# EAGLE design RS232_NPN_PNP+Reset (EAGLE 7.7.0)
RS232 Adapter using NPN and PNP Transistors
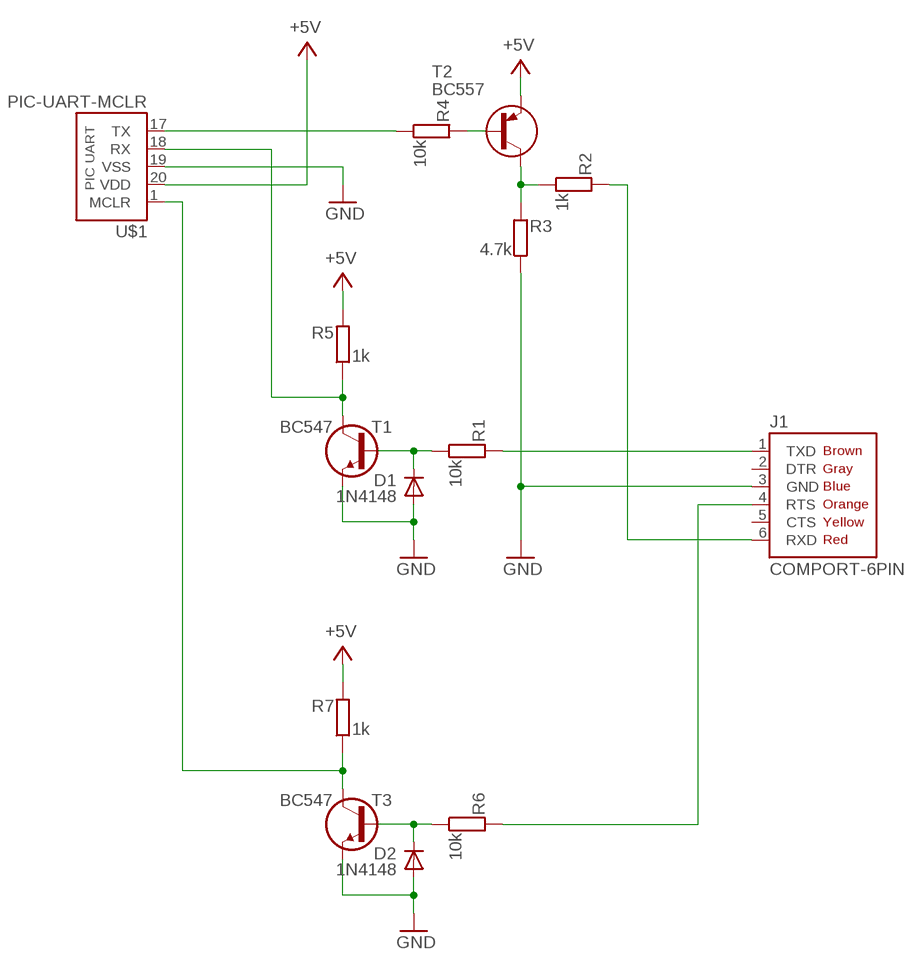
[diagram p0: schematic, sheet 1]

## Parts
D1  1N4148  1N414834-5  [DO34-5]
D2  1N4148  1N414834-5  [DO34-5]
J1  COMPORT-6PIN  [RS232-6PIN]
R1  10k  R0202/5  [0202/5]
R2  1k  R0202/5  [0202/5]
R3  4.7k  R0202/5  [0202/5]
R4  10k  R0202/5  [0202/5]
R5  1k  R0202/5  [0202/5]
R6  10k  R0202/5  [0202/5]
R7  1k  R0202/2V  [0202/2V]
T1  BC547  BC547CBE  [TO92-CBE]
T2  BC557  BC557CBE  [TO92-CBE]
T3  BC547  BC547CBE  [TO92-CBE]
U$1  PIC-UART-MCLR  [PIC-UART-MCLR]

## Nets
+5V: R5.2 R7.2 T2.E U$1.20(VDD)
GND: D1.A D2.A J1.3(GND) R3.1 T1.E T3.E U$1.19(VSS)
N$1: R5.1 T1.C U$1.18(RX)
N$2: D1.C R1.1 T1.B
N$3: J1.1(TXD) R1.2
N$4: R4.1 U$1.17(TX)
N$5: R4.2 T2.B
N$6: R2.1 R3.2 T2.C
N$7: J1.6(RXD) R2.2
N$8: R7.1 T3.C U$1.1(MCLR)
N$9: D2.C R6.1 T3.B
N$10: J1.4(RTS) R6.2
Unconnected: J1.2(DTR) J1.5(CTS)

## Library data of the parts
D1 D2 = d:1N4148
J1 = pinconn:COMPORT-6PIN
R1-R7 = r:R: RESISTOR, European symbol
T1 T3 = t:BC547
T2 = t:BC557
U$1 = pinconn:PIC-UART-MCLR

## Board
RS232 Adapter using NPN and PNP Transistors
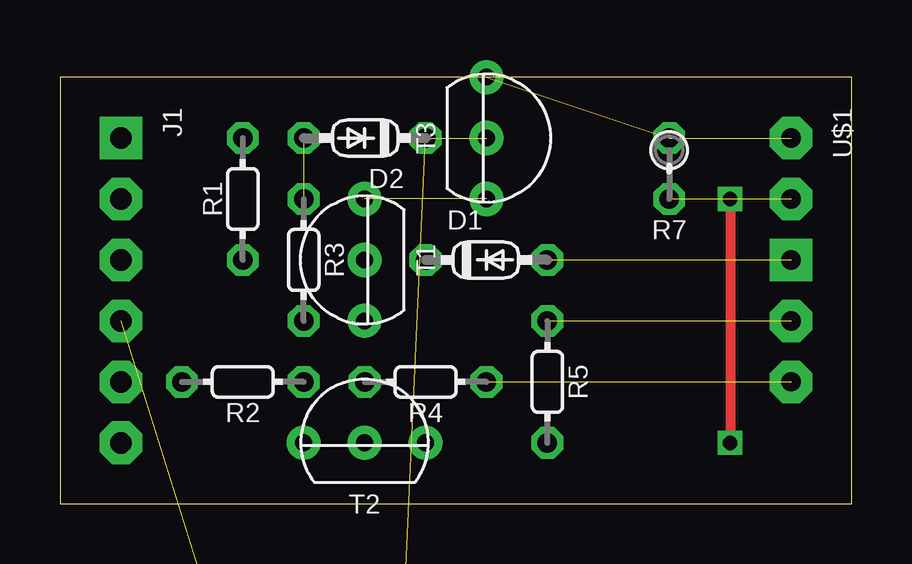
[diagram p1: board, top side]
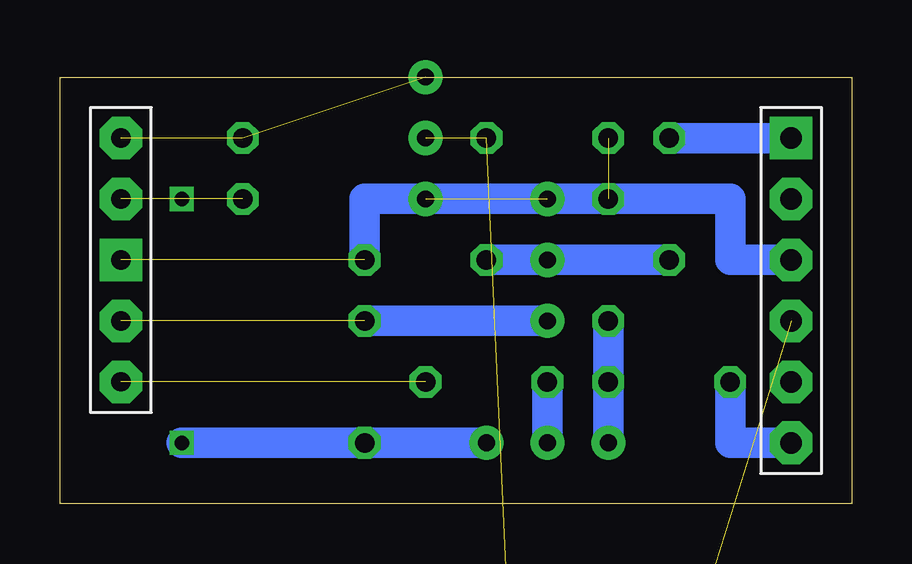
[diagram p2: board, bottom side, seen from below]

Size 33.02 x 17.78 mm. Coordinates in mm from the lower left corner, seen from the top.
Outline: 0,0 33,0 33.02,17.78 0,17.78 0,0
Copper layers (1*16): Top 0.035mm / dielectric 1.5mm / Bottom 0.035mm
Design rules "default": minimum track width 10mil, minimum drill 24mil, track to track 8mil, track to pad 8mil, pad to pad 8mil, via to via 8mil, smd to smd 8mil, copper to edge 40mil, drill to drill 8mil, minimum pad ring 10mil, minimum via ring 8mil, stop-mask expansion 4mil, vias tented up to drill 0mil, thermal gap 10mil

### Footprints (pad centres in the part's own frame; a part is rotated, then mirrored left to right if it is on the bottom)
DO34-5 = drill 0.813 octagon: A 2.54,0; C -2.54,0
RS232-6PIN = drill 0.9 pad 1.778 square: 1 0,0 | drill 0.9 pad 1.778 octagon: 2 2.54,0; 3 5.08,0; 4 7.62,0; 5 10.16,0; 6 12.7,0
0202/5 = drill 0.813 octagon: 1 0,-2.54; 2 0,2.54
0202/2V = drill 0.813 octagon: 1 0,-1.27; 2 0,1.27
TO92-CBE = drill 0.7 pad 1.422: B 0,0; C -2.54,0; E 2.54,0
PIC-UART-MCLR = drill 0.8 pad 1.778 octagon: 1 5.08,0; 17 -5.08,0; 18 -2.54,0; 20 2.54,0 | drill 0.8 pad 1.778 square: 19 0,0

### Placement (x,y rotation side)
D1  17.78,10.16 0 top
D2  12.7,15.24 180 top
J1  2.54,15.24 270 top
R1  7.62,12.7 0 top
R2  7.62,5.08 90 top
R3  10.16,10.16 180 top
R4  15.24,5.08 90 top
R5  20.32,5.08 180 top
R6  11.43,-12.7 90 top  (outside the outline)
R7  25.4,13.97 180 top
T1  12.7,10.16 90 top
T2  12.7,2.54 0 top
T3  17.78,15.24 270 top
U$1  30.48,10.16 90 top

### Tracks (layer width: path | path; a pad name or v marks a point on that pad's centre or on a via)
+5V  (via drill 0.6)  (2 unrouted)
  Top 0.406: v27.94,12.7 v27.94,2.54
  Bottom 1.27: R5.2 v27.94,2.54 T2.E
GND  (3 unrouted)
  Bottom 1.27: D1.A 20.32,12.7 T1.E R3.1 5.08,12.7 5.08,10.16 J1.3
N$1  (1 unrouted)
  Bottom 1.27: R5.1 T1.C
N$2
  Bottom 1.27: D1.C T1.B R1.1
N$3
  Bottom 1.27: R1.2 J1.1
N$4  (1 unrouted)
N$5
  Bottom 1.27: T2.B R4.2
N$6
  Bottom 1.27: R3.2 R2.1 T2.C
N$7
  Bottom 1.27: R2.2 5.08,2.54 J1.6
N$8  (2 unrouted)
N$9  (2 unrouted)
N$10  (1 unrouted)